# Altium schematic sheet barra_sec_secundaria.SchDoc
size A4
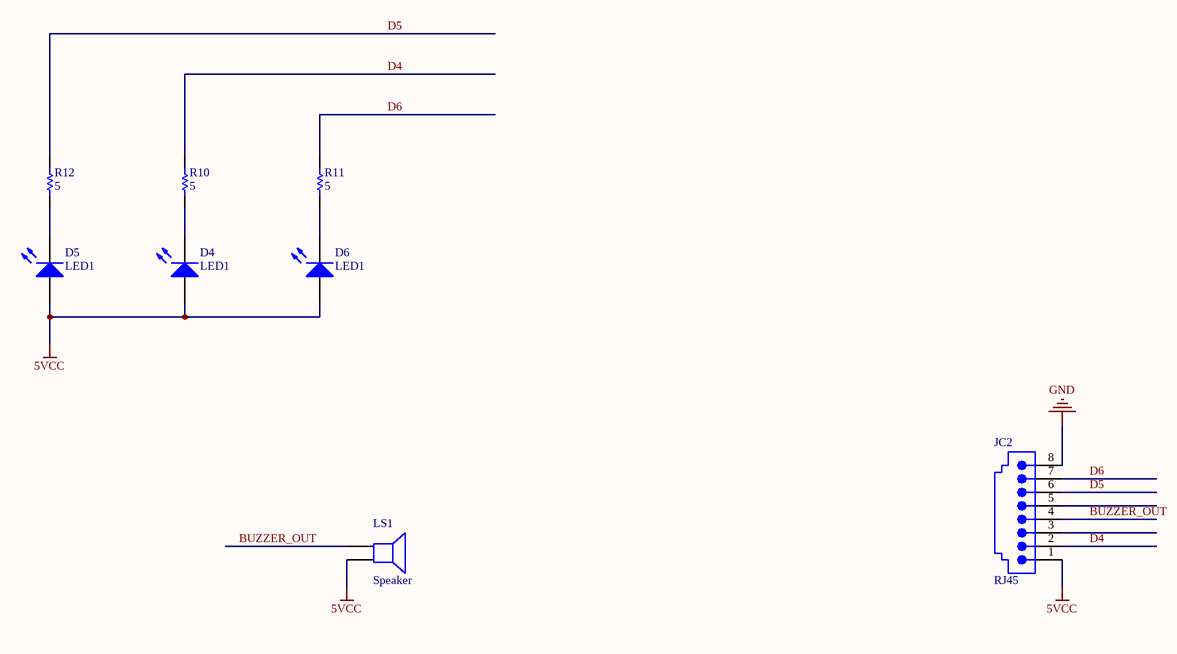
[diagram p0: barra_sec_secundaria.SchDoc]

## Parts
D4  LED1  [LED5MM RED]
D5  LED1  [LED5MM RED]
D6  LED1  [LED5MM RED]
JC2  RJ45  [15-43-6233]
LS1  Speaker  [C100UFA]
R10  value 5  [AXIAL-0.3]  (hidden comment: Res)
R11  value 5  [AXIAL-0.3]  (hidden comment: Res)
R12  value 5  [AXIAL-0.3]  (hidden comment: Res)

## Nets
5VCC: D4.1(A) D5.1(A) D6.1(A) JC2.1 LS1.2
GND: JC2.8
BUZZER_OUT: JC2.4 LS1.1
D4: JC2.2 R10.2
D5: JC2.6 R12.2
D6: JC2.7 R11.2
NetD4_2: D4.2(K) R10.1
NetD5_2: D5.2(K) R12.1
NetD6_2: D6.2(K) R11.1

Not connected (* = marked no-connect by the designer): JC2 3 5

## Library data of the parts
D4-D6 = LED1: Typical RED GaAs LED; Published: 8-Jun-2000; LatestRevisionDate: 08-Jul-2005; LatestRevisionNote: Mech Layer 1 removed.; PackageReference: LED-1; Publisher: Altium Limited
JC2 = 15-43-6233: Right Angle, Standard Profile, RJ45-Keyed, Flange Mount PCB Jack; Ports: 1; Positions/Loaded: Port1 - 8 Keyed/8; PerformanceCategory: 3; PCB_Mounting: Thru-Hole; ComponentAvailability: Obsolete; DrillSize: Nominal, Rounded to nearest 0.05mm; PCB_Layout: Complies with Manufacturer's Recommendation.; Published: 25-Jun-2002; DatasheetDocument: 18-Dec-2001; PackageDocument: 18-Dec-2001; PackageReference: 15-43-6233; Publisher: Altium Limited; ComponentLink1Description: Manufacturer Link; ComponentLink1URL: http://www.molex.com/; ComponentLink2Description: Datasheet; ComponentLink2URL: http://www.molex.com/cmc_upload/common_files/1212003_catalogmx41314.pdf; ComponentLink3Description: Iges Model; ComponentLink3URL: http://www.molex.com/pdm_docs/igs/15-43-6233_igs.zip
LS1 = Speaker: Loudspeaker; Published: 24-Mar-1999; LatestRevisionDate: 17-Jul-2002; LatestRevisionNote: Re-released for DXP Platform.; PackageReference: PIN2; Publisher: Altium Limited
R10-R12 = Res1: Resistor; Published: 8-Jun-2000; LatestRevisionDate: 17-Jul-2002; LatestRevisionNote: Re-released for DXP Platform.; PackageReference: AXIAL-0.3; Publisher: Altium Limited